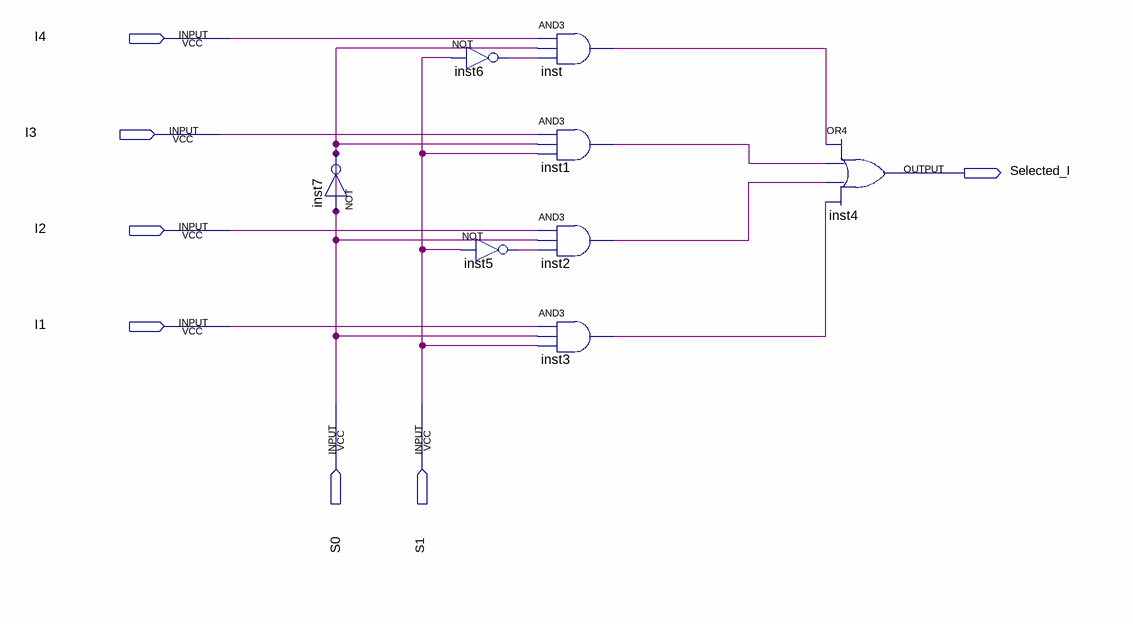
[diagram p0: schematic sheet]
// Quartus schematic mux_4x1.bdf as structural Verilog: 8 symbols, 7 pins
module mux_4x1 (
  input  I4,
  input  I3,
  input  I2,
  input  I1,
  input  S0,
  input  S1,
  output Selected_I
);

  wire inst1_out, inst2_out, inst3_out, inst5_out, inst6_out, inst_out;

  not inst7 (S0, S0);
  not inst6 (inst6_out, S1);
  not inst5 (inst5_out, S1);
  and inst (inst_out, I4, S0, inst6_out);
  and inst1 (inst1_out, I3, S0, S1);
  and inst2 (inst2_out, I2, S0, inst5_out);
  and inst3 (inst3_out, I1, S0, S1);
  or inst4 (Selected_I, inst_out, inst1_out, inst2_out, inst3_out);
endmodule
